# Altium project BUCK开关电源.PrjPcb
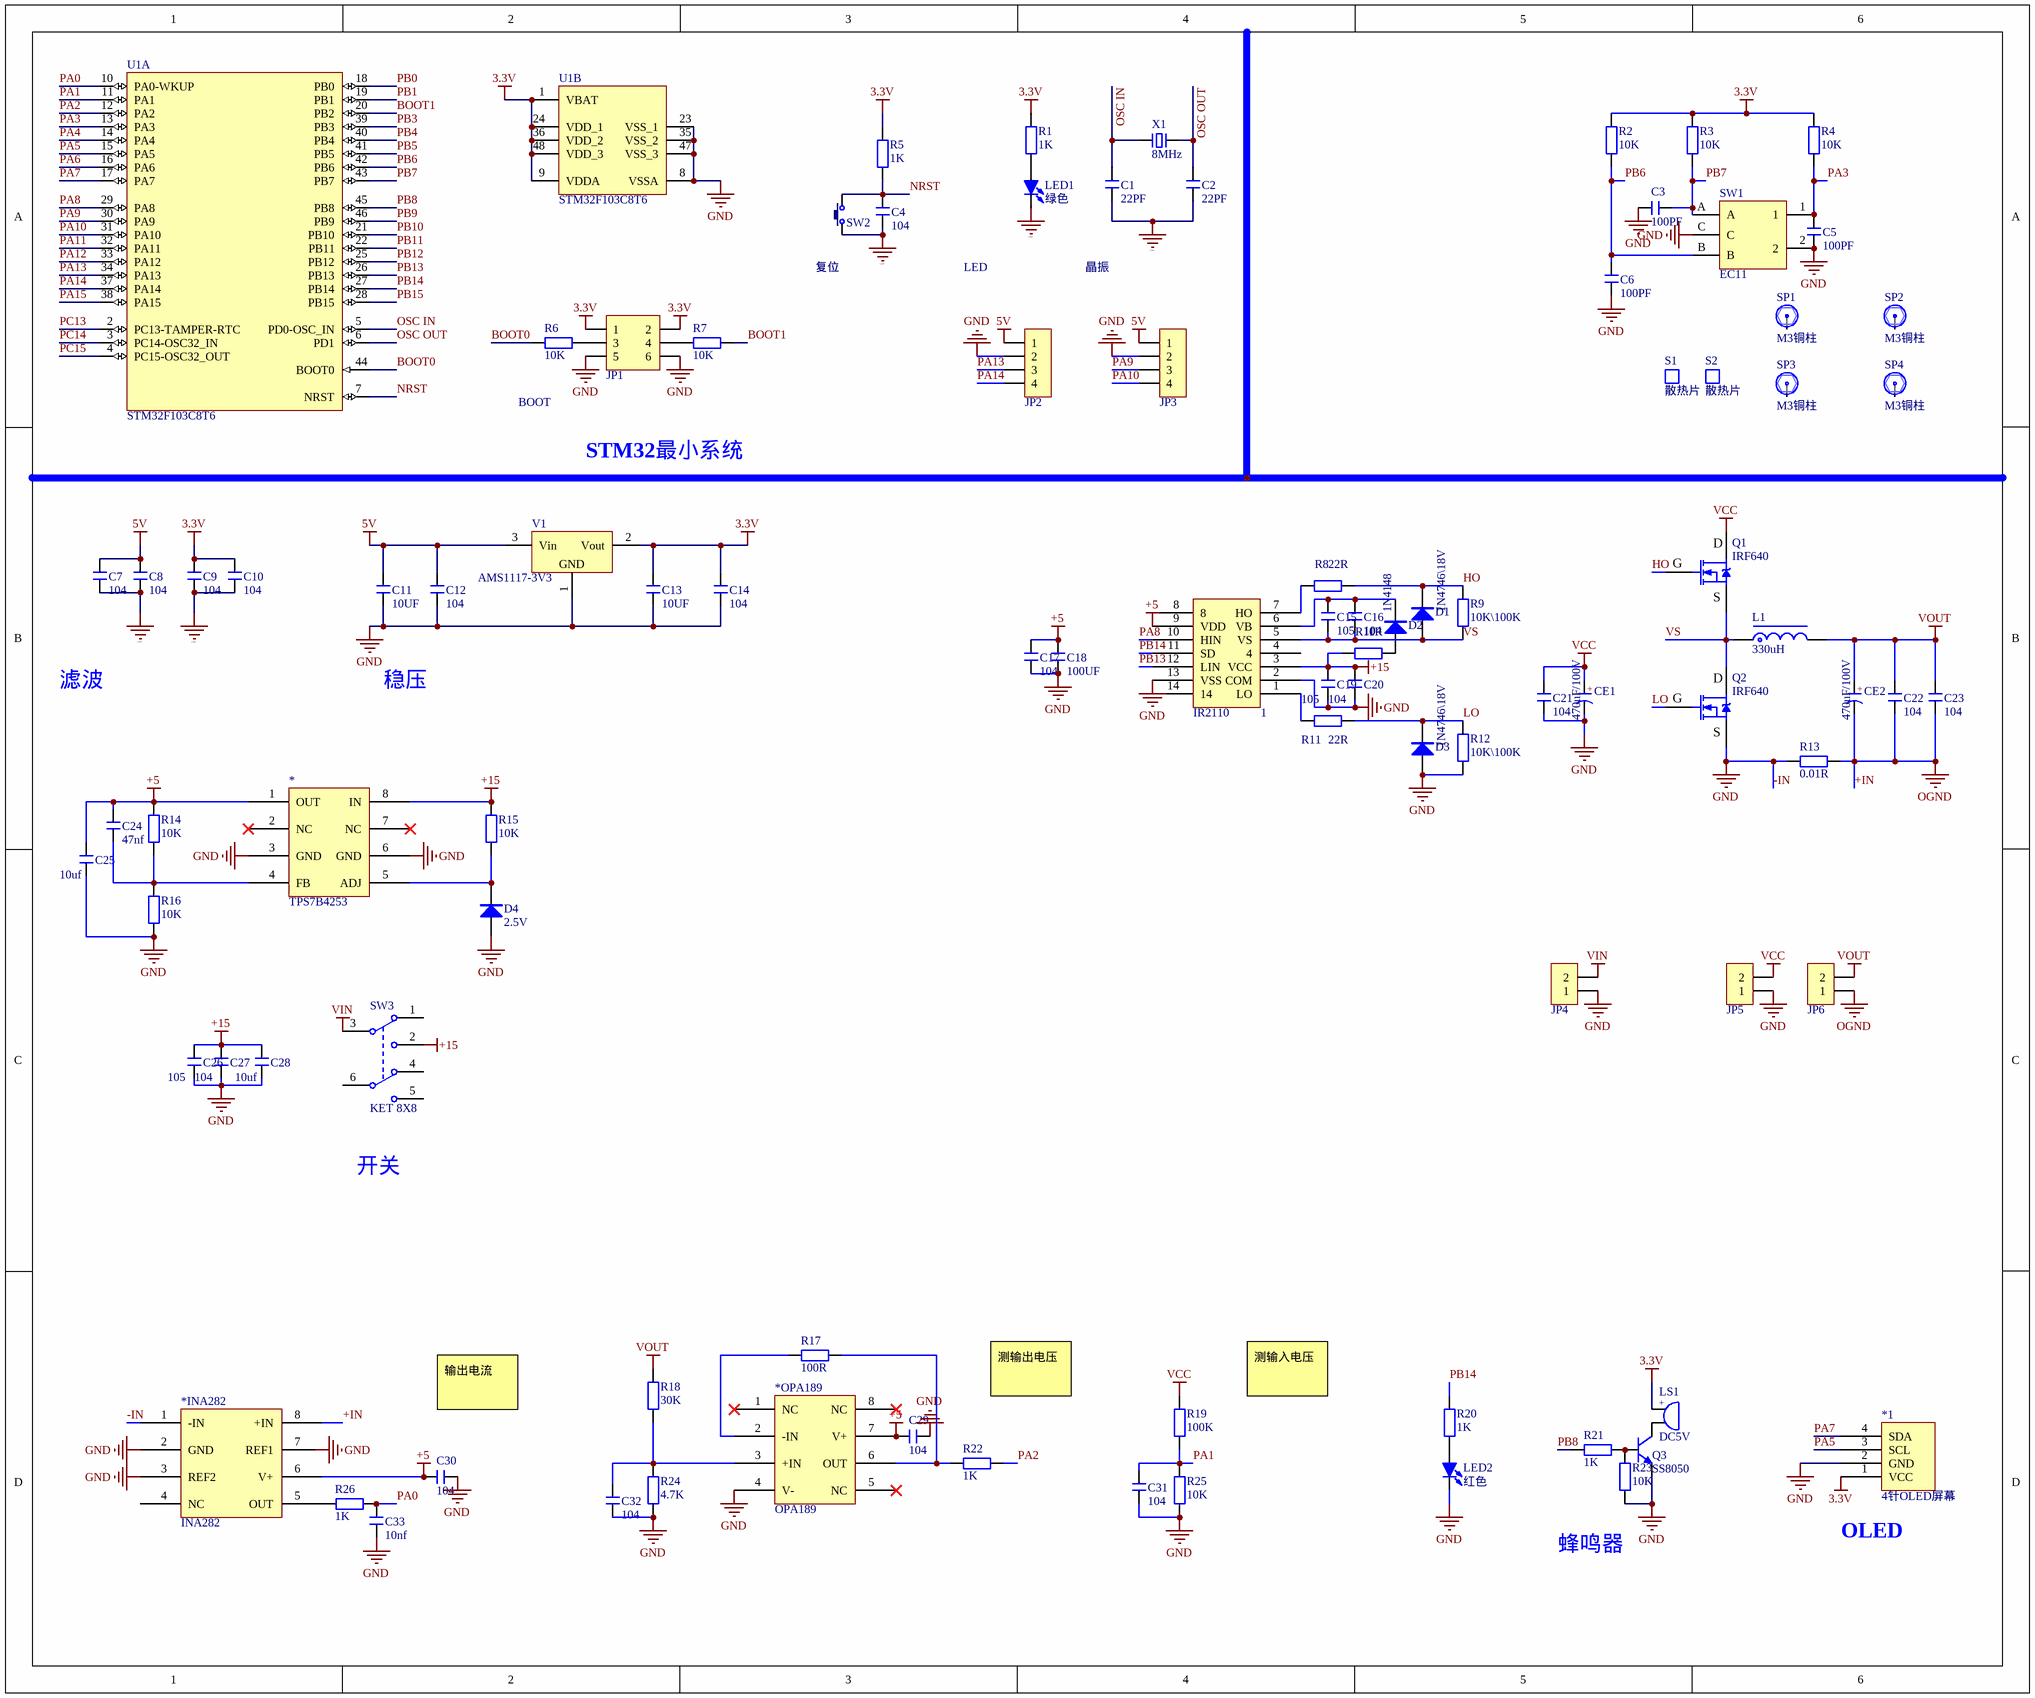
[diagram p0: BUCK开关电源.SchDoc]
1 sheet, 95 parts. Net scope: global (net labels, ports and power ports of the same name join across sheets).
Board file: BUCK开关电源.PcbDoc

## Sheet BUCK开关电源.SchDoc
size 381 x 317 mm; SheetNumber: 1; SheetTotal: 1

### Parts
1  IR2110  [DIP14-300_MH]
*  TPS7B4253  [SOP8_M]
*1  4针OLED屏幕  [4针OLED屏幕]
*INA282  INA282  [SOP8_M]
*OPA189  OPA189  [SOP8_M]
C1  22PF  [C 0805_L]
C2  22PF  [C 0805_L]
C3  100PF  [C 0805_L]
C4  104  [C 0805_L]
C5  100PF  [C 0805_L]
C6  100PF  [C 0805_L]
C7  104  [C 0805_L]
C8  104  [C 0805_L]
C9  104  [C 0805_L]
C10  104  [C 0805_L]
C11  10UF  [C 0805_L]
C12  104  [C 0805_L]
C13  10UF  [C 0805_L]
C14  104  [C 0805_L]
C15  105  [C 0805_L]
C16  104  [C 0805_L]
C17  104  [C 0805_L]
C18  100UF  [C 0805_L]
C19  105  [C 0805_L]
C20  104  [C 0805_L]
C21  104  [C 0805_L]
C22  104  [C 0805_L]
C23  104  [C 0805_L]
C24  47nf  [C 0805_L]
C25  10uf  [C 0805_L]
C26  105  [C 0805_L]
C27  104  [C 0805_L]
C28  10uf  [C 0805_L]
C29  104  [C 0805_L]
C30  104  [C 0805_L]
C31  104  [C 0805_L]
C32  104  [C 0805_L]
C33  10nf  [C 0805_L]
CE1  470uF/100V  [CAP 7.5*16*25 - BK]
CE2  470uF/100V  [CAP 7.5*16*25 - BK]
D1  1N4746\18V  [DO-35]
D2  1N4148  [DO-35]
D3  1N4746\18V  [DO-35]
D4  2.5V  [DO-35]
JP1  Header3X2  [HDR2.54-LI-2x3P]  (value not drawn)
JP2  HDR-1X4  [HDR2.54-WI-4P]  (value not drawn)
JP3  HDR-1X4  [HDR2.54-LI-4P]  (value not drawn)
JP4  HDR-1X2  [KF128-5.08-2P]  (value not drawn)
JP5  HDR-1X2  [KF128-5.08-2P]  (value not drawn)
JP6  HDR-1X2  [KF128-5.08-2P]  (value not drawn)
L1  330uH  [直插磁环电感（大）]
LED1  绿色  [LED 0805W]
LED2  红色  [LED 0603B]
LS1  DC5V  [BEEP 7.6X12X7.5]
Q1  IRF640  [TO220A]
Q2  IRF640  [TO220A]
Q3  SS8050  [TO92A]
R1  1K  [R 0805_L]
R2  10K  [R 0805_L]
R3  10K  [R 0805_L]
R4  10K  [R 0805_L]
R5  1K  [R 0805_L]
R6  10K  [R 0805_L]
R7  10K  [R 0805_L]
R8  22R  [R 0805_L]
R9  10K\100K  [R 0805_L]
R10  1R  [R 0805_L]
R11  22R  [R 0805_L]
R12  10K\100K  [R 0805_L]
R13  0.01R  [R 2512_L]
R14  10K  [R 0805_L]
R15  10K  [R 0805_L]
R16  10K  [R 0805_L]
R17  100R  [R 0805_L]
R18  30K  [R 0805_L]
R19  100K  [R 0805_L]
R20  1K  [R 0805_L]
R21  1K  [R 0805_L]
R22  1K  [R 0805_L]
R23  10K  [R 0805_L]
R24  4.7K  [R 0805_L]
R25  10K  [R 0805_L]
R26  1K  [R 0805_L]
S1  散热片  [SRP10-15-21]
S2  散热片  [SRP10-15-21]
SP1  M3铜柱  [M3x4+6_L]
SP2  M3铜柱  [M3x4+6_L]
SP3  M3铜柱  [M3x4+6_L]
SP4  M3铜柱  [M3x4+6_L]
SW1  EC11  [EC11-B]
SW2  3x6x5  [TSW SMD-3*6*2.5]  (value not drawn)
SW3  KET 8X8  [KFT DIP-8X8]
U1  STM32F103C8T6  [LQFP48_N]  (parts A,B of 2)
V1  AMS1117-3V3  [SOT223_L]
X1  8MHz  [OSC HC-49S]

### Nets
3.3V: *1.1(VCC) C9.2 C10.2 C13.2 C14.2 JP1.1 JP1.2 LS1.1 R1.2 R2.2 R3.2 R4.2 R5.2 U1.1(VBAT) U1.9(VDDA) U1.24(VDD_1) U1.36(VDD_2) U1.48(VDD_3) V1.2(Vout)
5V: C7.2 C8.2 C11.2 C12.2 JP2.1 JP3.1 V1.3(Vin)
+5: 1.9(VDD) *.1(OUT) *INA282.6(V+) *OPA189.7(V+) C17.2 C18.2 C24.2 C25.2 C29.2 C30.1 R14.1
+15: 1.3(VCC) *.8(IN) C19.2 C20.2 C26.2 C27.2 C28.2 R10.1 R15.1 SW3.2(COM2)
+IN: *INA282.8(+IN) C22.1 C23.1 CE2.2(K) JP6.1 R13.2  [also labelled OGND]
-IN: 1.2(COM) 1.13(VSS) *.3(GND) *.6(GND) *1.2(GND) *INA282.1(-IN) *INA282.2(GND) *INA282.3(REF2) *OPA189.4(V-) C1.2 C2.2 C3.2 C4.2 C5.2 C6.1 C7.1 C8.1 C9.1 C10.1 C11.1 C12.1 C13.1 C14.1 C17.1 C18.1 C19.1 C20.1 C21.1 C25.1 C26.1 C27.1 C28.1 C29.1 C30.2 C31.1 C32.1 C33.1 CE1.2(K) D3.1(A) D4.1(A) JP1.5 JP1.6 JP2.2 JP3.2 JP4.1 JP5.1 LED1.2(K) LED2.2(K) Q2.3(S) Q3.1(E) R12.1 R13.1 R16.2 R23.1 R24.2 R25.2 SW1.2 SW1.C SW2.1 U1.8(VSSA) U1.23(VSS_1) U1.35(VSS_2) U1.47(VSS_3) V1.1(GND)  [also labelled GND]
VCC: C21.2 CE1.1(A) JP5.2 Q1.2(D) R19.1
VIN: JP4.2 SW3.3(NO1)
VOUT: C22.2 C23.2 CE2.1(A) JP6.2 L1.2 R18.1
BOOT0: R6.1 U1.44(BOOT0)
BOOT1: R7.1 U1.20(PB2)
HO: D1.2(K) Q1.1(G) R8.2 R9.2
LO: D3.2(K) Q2.1(G) R11.2 R12.2
NRST: C4.1 R5.1 SW2.2 U1.7(NRST)
OSC IN: C1.1 U1.5(PD0-OSC_IN) X1.1
OSC OUT: C2.1 U1.6(PD1) X1.2
PA0: C33.2 R26.1 U1.10(PA0-WKUP)
PA1: C31.2 R19.2 R25.1 U1.11(PA1)
PA2: R22.1 U1.12(PA2)
PA3: C5.1 R4.1 SW1.1 U1.13(PA3)
PA4: U1.14(PA4)
PA5: *1.3(SCL) U1.15(PA5)
PA6: U1.16(PA6)
PA7: *1.4(SDA) U1.17(PA7)
PA8: 1.10(HIN) U1.29(PA8)
PA9: JP3.3 U1.30(PA9)
PA10: JP3.4 U1.31(PA10)
PA11: U1.32(PA11)
PA12: U1.33(PA12)
PA13: JP2.3 U1.34(PA13)
PA14: JP2.4 U1.37(PA14)
PA15: U1.38(PA15)
PB0: U1.18(PB0)
PB1: U1.19(PB1)
PB3: U1.39(PB3)
PB4: U1.40(PB4)
PB5: U1.41(PB5)
PB6: C6.2 R2.1 SW1.B U1.42(PB6)
PB7: C3.1 R3.1 SW1.A U1.43(PB7)
PB8: R21.2 U1.45(PB8)
PB9: U1.46(PB9)
PB10: U1.21(PB10)
PB11: U1.22(PB11)
PB12: U1.25(PB12)
PB13: 1.12(LIN) U1.26(PB13)
PB14: 1.11(SD) R20.2 U1.27(PB14)
PB15: U1.28(PB15)
PC13: U1.2(PC13-TAMPER-RTC)
PC14: U1.3(PC14-OSC32_IN)
PC15: U1.4(PC15-OSC32_OUT)
VS: 1.5(VS) C15.1 C16.1 D1.1(A) L1.1 Q1.3(S) Q2.2(D) R9.1
Net1_1: 1.1(LO) R11.1
Net1_6: 1.6(VB) C15.2 C16.2 D2.2(K)
Net1_7: 1.7(HO) R8.1
Net*_4: *.4(FB) C24.1 R14.2 R16.1
Net*_5: *.5(ADJ) D4.2(K) R15.2
Net*INA282_5: *INA282.5(OUT) R26.2
Net*OPA189_2: *OPA189.2(-IN) R17.2
Net*OPA189_3: *OPA189.3(+IN) C32.2 R18.2 R24.1
Net*OPA189_6: *OPA189.6(OUT) R17.1 R22.2
NetD2_1: D2.1(A) R10.2
NetJP1_3: JP1.3 R6.2
NetJP1_4: JP1.4 R7.2
NetLED1_1: LED1.1(A) R1.1
NetLED2_1: LED2.1(A) R20.1
NetLS1_2: LS1.2 Q3.3(C)
NetQ3_2: Q3.2(B) R21.1 R23.2

Not connected (* = marked no-connect by the designer): 1 4 8 14; * 2(NC)* 7(NC)*; *INA282 4(NC) 7(REF1); *OPA189 1(NC)* 5(NC)* 8(NC)*; SP1 1; SP2 1; SP3 1; SP4 1; SW3 1(NC1) 4(NO2) 5(COM2) 6(NC2)

### Notes on the sheet
- (near SW2) 复位
- LED
- 晶振
- BOOT
- STM32最小系统
- 滤波
- 稳压
- 开关
- 输出电流
- 测输出电压
- 测输入电压
- 蜂鸣器
- (near *1) OLED
- Labels drawn without touching a wire or pin: GND
- (in symbol BEEP) +
- (in symbol CE) +

### Library data of the parts
1 = Component_1
C1-C33 = C: 贴片电容; BOM名称: 无极性贴片电容; 淘宝ID: 封装库来自淘宝 ID：黄晶宝石; 联系售后，技术支持: https://shop463601444.taobao.com; 唯一出售店铺网址: https://shop463601444.taobao.com
CE1 CE2 = CE: 直插电解电容; 淘宝ID: 封装库来自淘宝 ID：黄晶宝石; BOM名称: 直插电解电容; 联系售后: https://shop463601444.taobao.com
D1-D4 = 1N4148: 开关二极管; BOM名称: 高速开关二极管; 淘宝ID: 封装库来自淘宝 ID：黄晶宝石; 欢迎光临: https://shop463601444.taobao.com
JP1 = Header 3X2: 3*2P接插件; 版权归属: 封装库来自淘宝 ID：黄晶宝石; BOM名称: 3*2P接插件; 学习资源: https://shop463601444.taobao.com
JP2 JP3 = Header 4: 4P接插件; 版权归属: 封装库来自淘宝 ID：黄晶宝石; BOM名称: 4P接插件; 学习资源: https://shop463601444.taobao.com
JP4-JP6 = Header 2: 2P接插件; 版权归属: 封装库来自淘宝卖家 ID：黄晶宝石; BOM名称: 2P接插件; 学习资源: https://shop463601444.taobao.com
L1 = L-MR: 功率磁环电感; 淘宝ID: 封装库来自淘宝 ID：黄晶宝石; BOM名称: 功率磁环电感; 联系售后: https://shop463601444.taobao.com
LED1 LED2 = LED-SMD: 贴片LED; 版权归属: 封装库来自淘宝 ID：黄晶宝石; BOM名称: 贴片LED; 学习资源: https://shop463601444.taobao.com
LS1 = BEEP: 蜂鸣器; 版权归属: 封装库来自淘宝 ID：黄晶宝石; BOM名称: 蜂鸣器; 技术支持，联系售后: https://shop463601444.taobao.com
Q1 Q2 = IRF840: N沟场效应管; BOM名称: N沟场效应管; 技术支持，联系售后: https://shop463601444.taobao.com
Q3 = 8050-DIP: 高频放大-NPN型; 版权归属: 封装库来自淘宝 ID：黄晶宝石; 属性: 40V 1.5A 1W 100MHZ; BOM名称: 高频放大-NPN型; 技术支持，联系售后: https://shop463601444.taobao.com
R1-R26 = R: 贴片电阻; 版权归属: 来自淘宝 ID：黄晶宝石; 封装库来自淘宝卖家 ID：黄晶宝石: 其他店铺购入均为盗版，不享受售后技术支持服务，请立即申请退款; BOM名称: 贴片电阻; 联系售后: https://shop463601444.taobao.com
S1 S2 = S1: 版权归属: 封装库来自淘宝 ID：黄晶宝石; BOM名称: 散热片; 学习资源: https://shop463601444.taobao.com
SP1-SP4 = 铜柱加头小焊盘: 铜柱; 版权归属: 封装库来自淘宝 ID：黄晶宝石; BOM名称: 铜柱; 学习资源: https://shop463601444.taobao.com
SW1 = EC11: 数字开关编码器; BOM名称: 数字编码开关; 版权归属: 封装库来自淘宝 ID：黄晶宝石; 封装库来自淘宝卖家 ID：黄晶宝石: 其他店铺购入均为盗版，不享受售后技术支持服务，请立即申请退款; 技术支持，联系售后: https://shop463601444.taobao.com
SW2 = TSW 3x6: 3x6轻触开关; 版权归属: 封装库来自淘宝 ID：黄晶宝石; BOM名称: 3x6轻触开关; 学习资源: https://shop463601444.taobao.com
SW3 = KET 8X8: 8*8自锁开关; 版权归属: 封装库来自淘宝 ID：黄晶宝石; BOM名称: 8*8自锁开关; 学习资源: https://shop463601444.taobao.com
U1 = STM32F103C8T6: STM32 ARM-based 32-bit MCU Performance Line with 64 kB Flash, 20 kB Internal RAM, -40 to +85癈 Temperature, 48-Pin LQFP, Tray; DatasheetVersion: rev13.0, Apr-2011; PackageVersion: rev13, Apr-2011; PackageReference: LQFP48; PackageDescription: 48-Pin Low-Profile Quad Flat Pack, 7 x 7 mm Body, 0.5 mm Pitch (LQFP48); ComponentLink1Description: Manufacturer URL; ComponentLink1URL: http://www.st.com/; ComponentLink2Description: STM32F103 Datasheet; ComponentLink2URL: http://www.st.com/internet/com/TECHNICAL_RESOURCES/TECHNICAL_LITERATURE/DATASHEET/CD00161566.pdf; ComponentLink3Description: STM32 Family Web Page; ComponentLink3URL: www.st.com/stm32; 联系售后: https://shop463601444.taobao.com
V1 = AMS1117: 三端稳压芯片; BOM名称: 稳压芯片; 淘宝ID: 封装库来自淘宝 ID：黄晶宝石; 欢迎光临淘宝店铺: https://shop463601444.taobao.com
X1 = XTAL-2P: 2脚无源脚晶振; 版权归属: 封装库来自淘宝卖家 ID：黄晶宝石; BOM名称: 2脚无源脚晶振; 学习资源: https://shop463601444.taobao.com